# EAGLE schematic teplomer (EAGLE 9.0.1)
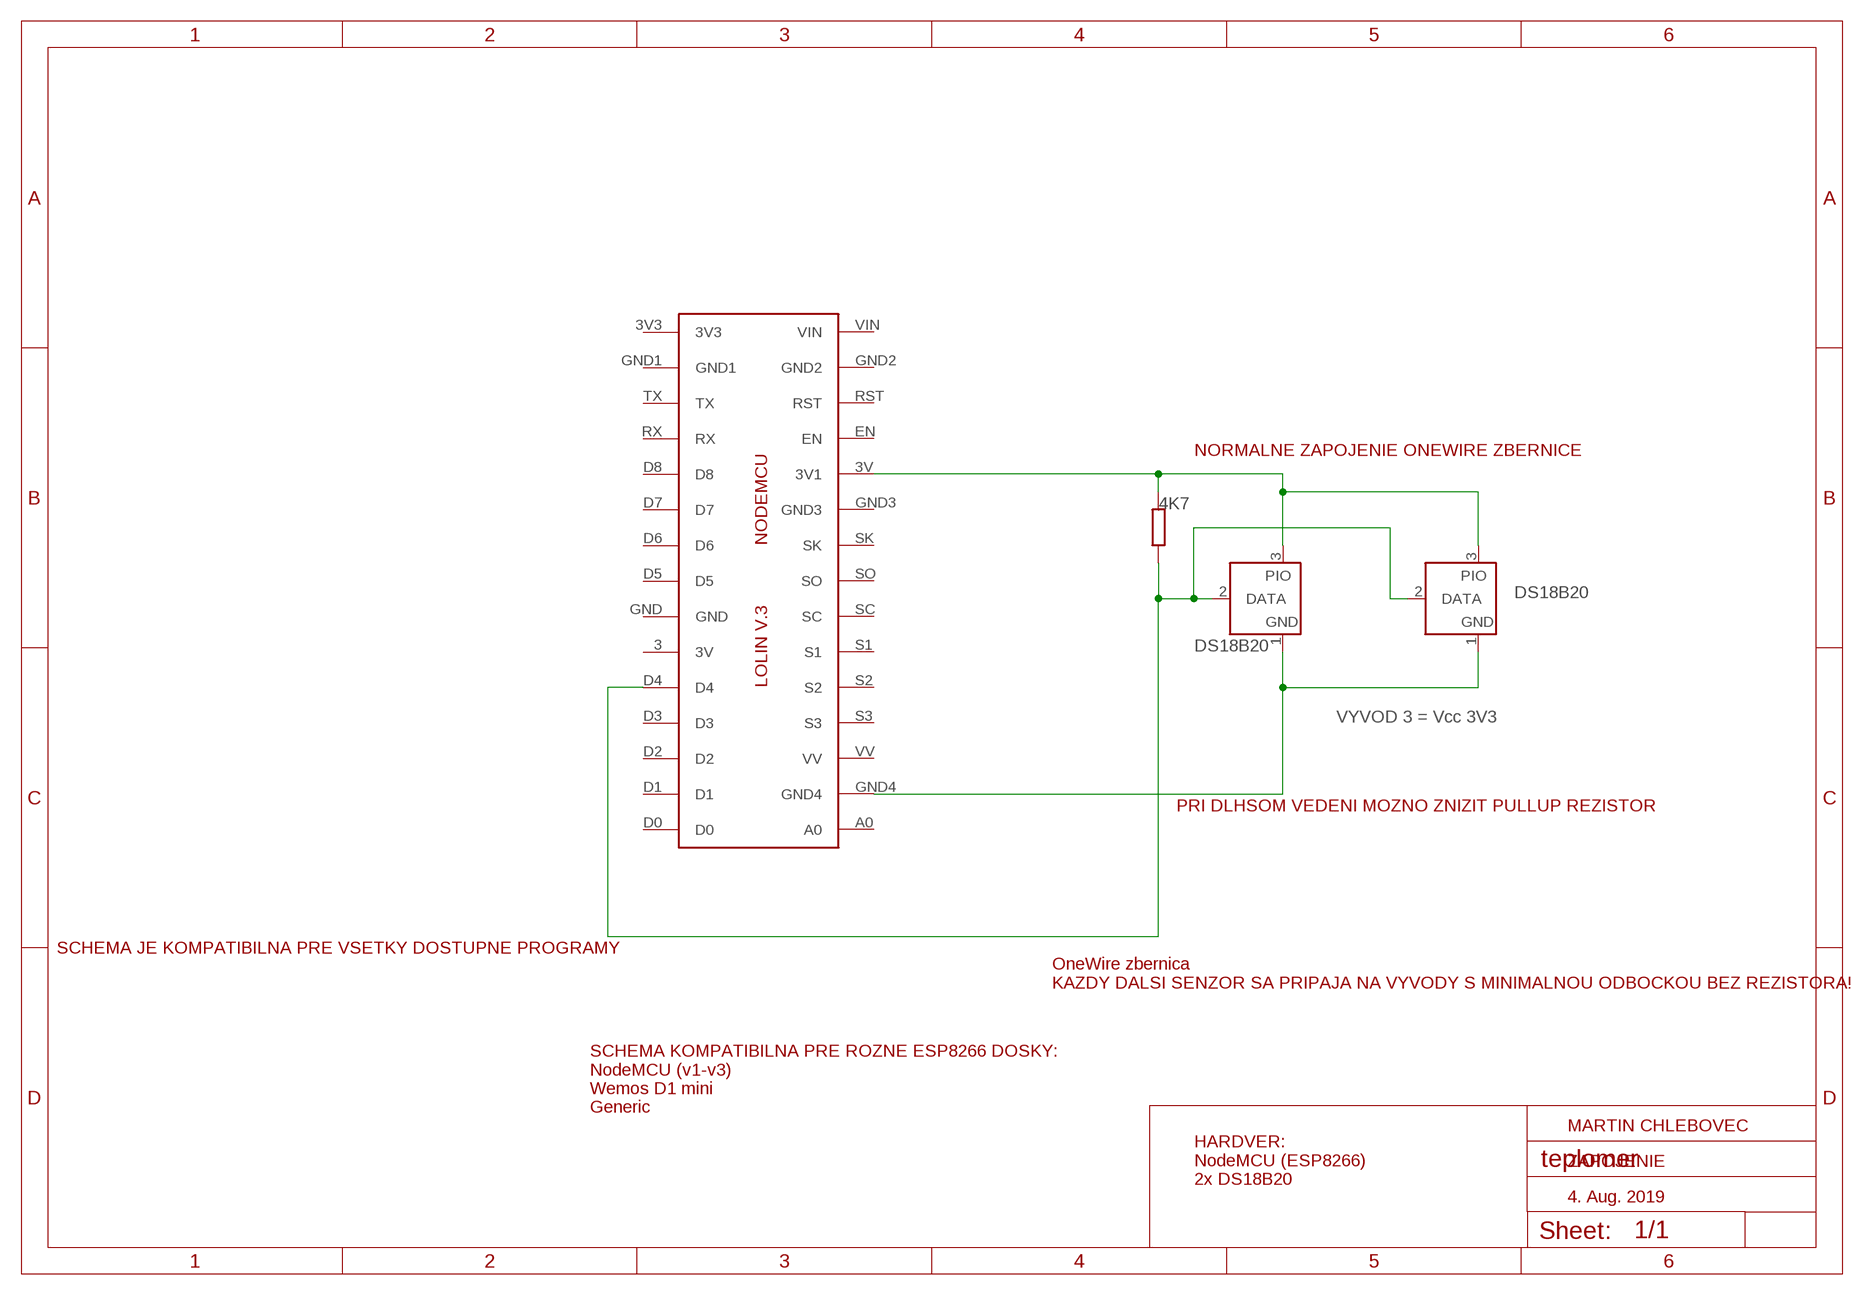
[diagram p0: schematic, sheet 1]

## Parts
IC1  LOLINV3  [LOLINV3]
IC2  DS2405  [TO92-]
IC3  DS2405  [TO92-]

## Nets
N$1: IC1.GND4 IC2.1(GND) IC3.1(GND)
N$2: IC1.D4 IC2.2(DATA) IC3.2(DATA)
N$4: IC1.3V(3V1) IC2.3(PIO) IC3.3(PIO)
Unconnected: IC1.3(3V) IC1.3V3 IC1.A0 IC1.D0 IC1.D1 IC1.D2 IC1.D3 IC1.D5 IC1.D6 IC1.D7 IC1.D8 IC1.EN IC1.GND IC1.GND1 IC1.GND2 IC1.GND3 IC1.RST IC1.RX IC1.S1 IC1.S2 IC1.S3 IC1.SC IC1.SK IC1.SO IC1.TX IC1.VIN IC1.VV

## Notes on the sheet
- NORMALNE ZAPOJENIE ONEWIRE ZBERNICE
- 4K7
- DS18B20
- DS18B20
- VYVOD 3 = Vcc 3V3
- PRI DLHSOM VEDENI MOZNO ZNIZIT PULLUP REZISTOR
- SCHEMA JE KOMPATIBILNA PRE VSETKY DOSTUPNE PROGRAMY
- OneWire zbernica
  KAZDY DALSI SENZOR SA PRIPAJA NA VYVODY S MINIMALNOU ODBOCKOU BEZ REZISTORA!
- SCHEMA KOMPATIBILNA PRE ROZNE ESP8266 DOSKY:
  NodeMCU (v1-v3)
  Wemos D1 mini
  Generic
- MARTIN CHLEBOVEC
- ZAPOJENIE
- HARDVER:
  NodeMCU (ESP8266)
  2x DS18B20
- 4. Aug. 2019

## Library data of the parts
IC1 = Lolin:LOLINV3
IC2 IC3 = maxim:DS2405: Addressable Switch DALLAS Semiconductor; MF: DALLAS SEMICONDUCTOR; MPN: DS2405; OC_FARNELL: 1188025; OC_NEWARK: 06F4645

## Module RELE
Ports: 

### Library data of the parts